# EAGLE design gps_tracker_org1411 (EAGLE 7.4.0)

## Sheet 1 of 2
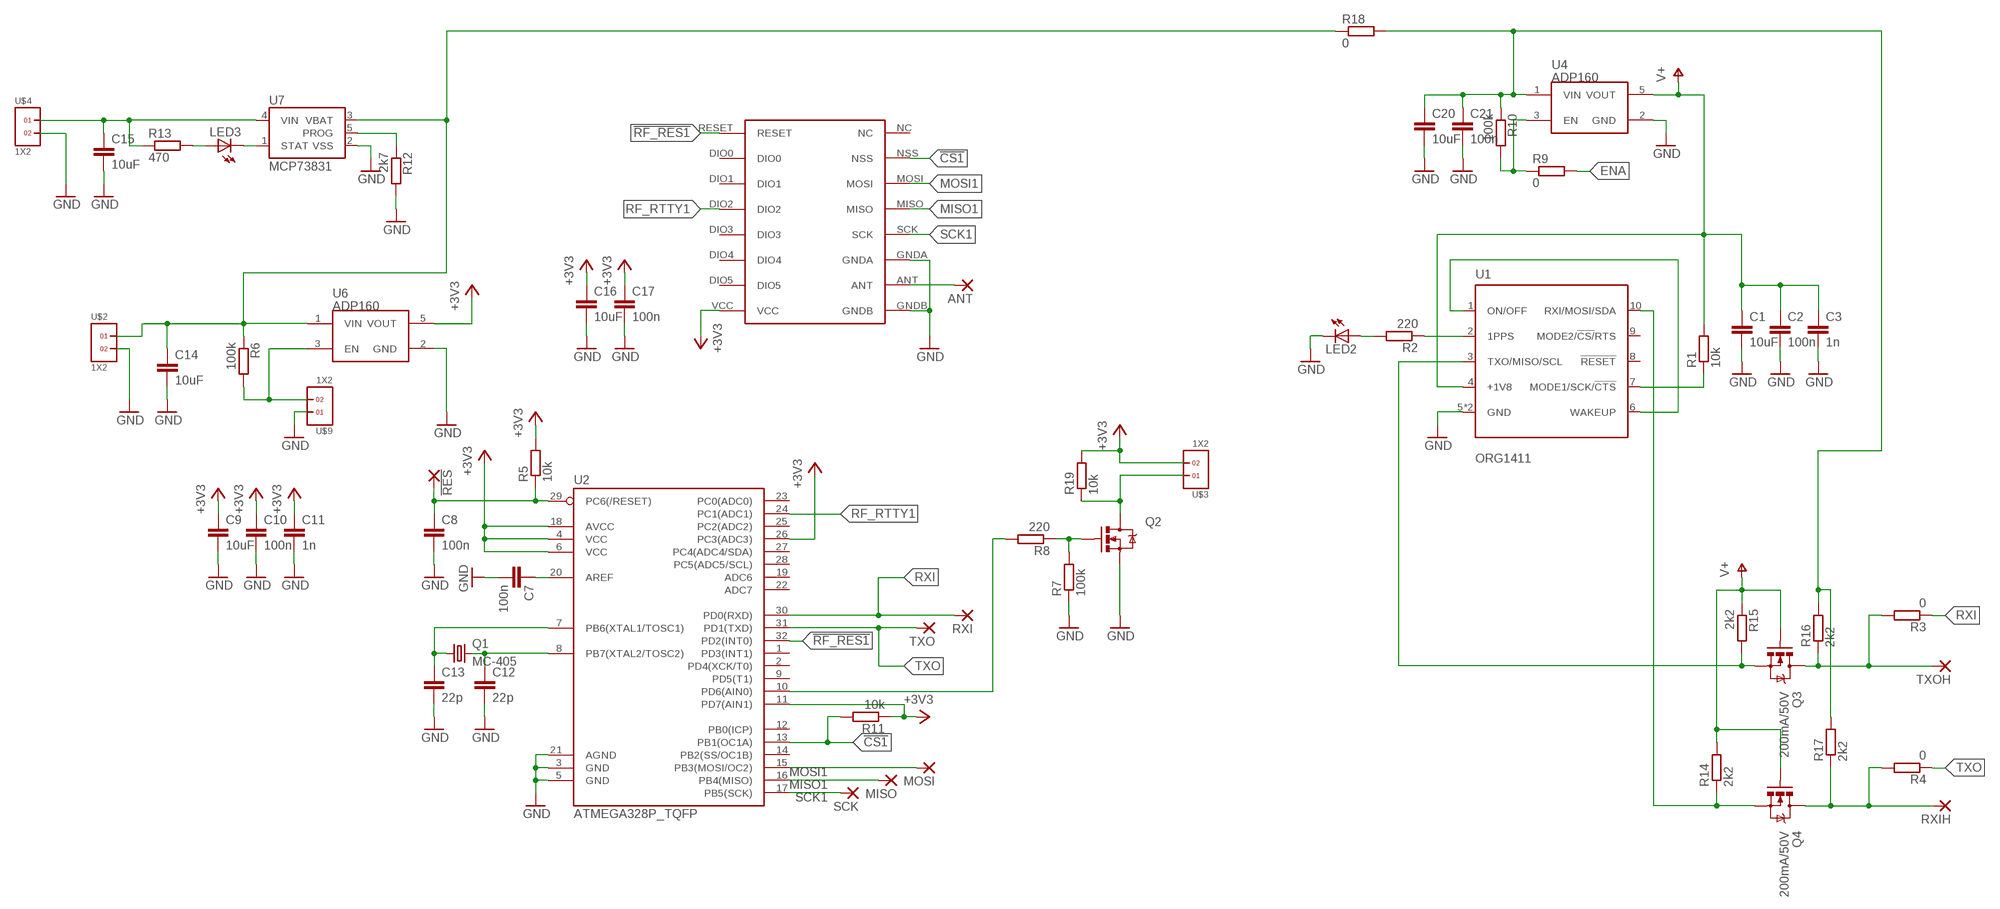
[diagram p0: schematic, sheet 1]

### Parts
!RES  SMD2  [SMD1,27-2,54]
ANT  SMD2  [SMD1,27-2,54]
C1  10uF  C-EUC0603  [C0603]
C2  100n  C-EUC0603  [C0603]
C3  1n  C-EUC0603  [C0603]
C7  100n  C-EUC0603  [C0603]
C8  100n  C-EUC0603  [C0603]
C9  10uF  C-EUC0603  [C0603]
C10  100n  C-EUC0603  [C0603]
C11  1n  C-EUC0603  [C0603]
C12  22p  C-EUC0603  [C0603]
C13  22p  C-EUC0603  [C0603]
C14  10uF  C-EUC0603  [C0603]
C15  10uF  C-EUC0603  [C0603]
C16  10uF  C-EUC0603  [C0603]
C17  100n  C-EUC0603  [C0603]
C20  10uF  C-EUC0603  [C0603]
C21  100n  C-EUC0603  [C0603]
LED2  LEDCHIPLED_0603  [CHIPLED_0603]
LED3  LEDCHIPLED_0603  [CHIPLED_0603]
MISO  SMD2  [SMD1,27-2,54]
MOSI  SMD2  [SMD1,27-2,54]
Q1  MC-405  [MC-405]
Q2  MOSFET-NCHANNELAO3404A  [SOT23-3]
Q3  200mA/50V  MOSFET-NCHANNELBSS138  [SOT23-3]
Q4  200mA/50V  MOSFET-NCHANNELBSS138  [SOT23-3]
R1  10k  R-EU_R0603  [R0603]
R2  220  R-EU_R0603  [R0603]
R3  0  R-EU_R0603  [R0603]
R4  0  R-EU_R0603  [R0603]
R5  10k  R-EU_R0603  [R0603]
R6  100k  R-EU_R0603  [R0603]
R7  100k  R-EU_R0603  [R0603]
R8  220  R-EU_R0603  [R0603]
R9  0  R-EU_R0603  [R0603]
R10  100k  R-EU_R0603  [R0603]
R11  10k  R-EU_R0603  [R0603]
R12  2k7  R-EU_R0603  [R0603]
R13  470  R-EU_R0603  [R0603]
R14  2k2  R-EU_R0603  [R0603]
R15  2k2  R-EU_R0603  [R0603]
R16  2k2  R-EU_R1206  [R1206]
R17  2k2  R-EU_R1206  [R1206]
R18  0  R-EU_R0603  [R0603]
R19  10k  R-EU_R0603  [R0603]
RXI  SMD2  [SMD1,27-2,54]
RXIH  SMD2  [SMD1,27-2,54]
SCK  SMD2  [SMD1,27-2,54]
TXO  SMD2  [SMD1,27-2,54]
TXOH  SMD2  [SMD1,27-2,54]
U1  ORG1411  [ORG1411]
U2  ATMEGA328P_TQFP  [TQFP32-08]
U4  ADP160  [SOT23-5]
U6  ADP160  [SOT23-5]
U7  MCP73831  [SOT23-5]
U$2  1X2  [1X2]
U$3  1X2  [1X2]
U$4  1X2  [1X2]
U$5  RFM69HW  [RFM]
U$9  1X2  [1X2]

### Nets
!CS1: R11.2 U2.13(PB1(OC1A)) U$5.NSS
!RF_RES1: U2.32(PD2(INT0)) U$5.RESET
+3V3_1: C9.1 C10.1 C11.1 C16.1 C17.1 R5.2 R11.1 R19.2 U2.4(VCC) U2.6(VCC) U2.11(PD7(AIN1)) U2.18(AVCC) U2.26(PC3(ADC3)) U6.5(VOUT) U$3.2 U$5.VCC ; supply symbol labelled +3V3
+BAT: C14.1 R6.1 R18.1 U6.1(VIN) U7.3(VBAT) U$2.1
ENA: R6.2 R9.2 U6.3(EN) U$9.2
GND: C1.2 C2.2 C3.2 C7.2 C8.2 C9.2 C10.2 C11.2 C12.2 C13.2 C14.2 C15.2 C16.2 C17.2 C20.2 C21.2 LED2.C Q2.2(S) R7.1 R12.2 U1.5(GND) U1.11(GND) U2.3(GND) U2.5(GND) U2.21(AGND) U4.2(GND) U6.2(GND) U7.2(VSS) U$2.2 U$4.2 U$5.GNDA U$5.GNDB U$9.1
MISO1: MISO.1(P) U2.16(PB4(MISO)) U$5.MISO
MOSI1: MOSI.1(P) U2.15(PB3(MOSI/OC2)) U$5.MOSI
N1: R9.1 R10.2 U4.3(EN)
N$1: U1.1(ON/OFF) U1.6(WAKEUP)
N$2: R1.1 U1.7(MODE1/SCK/!CTS)
N$3: R2.1 U1.2(1PPS)
N$4: LED2.A R2.2
N$5: Q3.2(S) R15.2 U1.3(TXO/MISO/SCL)
N$6: C20.1 C21.1 R10.1 R16.2 R17.2 R18.2 U4.1(VIN)
N$11: R12.1 U7.5(PROG)
N$12: C7.1 U2.20(AREF)
N$13: !RES.1(P) C8.1 R5.1 U2.29(PC6(/RESET))
N$14: ANT.1(P) U$5.ANT
N$15: C12.1 Q1.2 U2.8(PB7(XTAL2/TOSC2))
N$16: C13.1 Q1.1 U2.7(PB6(XTAL1/TOSC1))
N$18: LED3.C U7.1(STAT)
N$19: Q2.1(G) R7.2 R8.1
N$20: R8.2 U2.10(PD6(AIN0))
N$21: Q2.3(D) R19.1 U$3.1
N$22: LED3.A R13.2
N$24: C15.1 R13.1 U7.4(VIN) U$4.1
N$26: Q3.3(D) R3.2 R16.1 TXOH.1(P)
N$30: Q4.3(D) R4.2 R17.1 RXIH.1(P)
N$32: Q4.2(S) R14.1 U1.10(RXI/MOSI/SDA)
RF_RTTY1: U2.24(PC1(ADC1)) U$5.DIO2
RXI: R3.1 RXI.1(P) U2.30(PD0(RXD))
SCK1: SCK.1(P) U2.17(PB5(SCK)) U$5.SCK
TXO: R4.1 TXO.1(P) U2.31(PD1(TXD))
V+: C1.1 C2.1 C3.1 Q3.1(G) Q4.1(G) R1.2 R14.2 R15.1 U1.4(+1V8) U4.5(VOUT)
Unconnected: U1.8(!RESET) U1.9(MODE2/!CS/!RTS) U2.1(PD3(INT1)) U2.2(PD4(XCK/T0)) U2.9(PD5(T1)) U2.12(PB0(ICP)) U2.14(PB2(SS/OC1B)) U2.19(ADC6) U2.22(ADC7) U2.23(PC0(ADC0)) U2.25(PC2(ADC2)) U2.27(PC4(ADC4/SDA)) U2.28(PC5(ADC5/SCL)) U$5.DIO0 U$5.DIO1 U$5.DIO3 U$5.DIO4 U$5.DIO5 U$5.NC

## Sheet 2 of 2: A2235-H

## Library data of the parts
!RES ANT MISO MOSI RXI RXIH SCK TXO TXOH = wirepad:SMD2: SMD PAD
C1-C3 C7-C17 C20 C21 = rcl:C-EU: CAPACITOR, European symbol
LED2 LED3 = led:LED: LED OSRAM: - CHIPLED LG R971, LG N971, LY N971, LG Q971, LY Q971, LO R971, LY R971 LH N974, LH R974 LS Q976, LO Q976, LY Q976 LO Q996 - Hyper CHIPLED LW Q18S LB Q993, LB Q99A, LB R99A - SideLED LS A670, LO A670, LY A670, LG A670, LP A670 LB A673, LV A673, LT A673, LW A673 LH A674 LY A675 LS A676, LA A676, LO A676, LY A676, LW A676 LS A679, LY A679, LG A679 - Hyper Micro SIDELED® LS Y876, LA Y876, LO Y876, LY Y876 LT Y87S - SmartLED LW L88C, LW L88S LB L89C, LB L89S, LG L890 LS L89K, LO L89K, LY L89K LS L896, LA L896, LO L896, LY L896 - TOPLED LS T670, LO T670, LY T670, LG T670, LP T670 LSG T670, LSP T670, LSY T670, LOP T670, LYG T670 LG T671, LOG T671, LSG T671 LB T673, LV T673, LT T673, LW T673 LH T674 LS T676, LA T676, LO T676, LY T676, LB T676, LH T676, LSB T676, LW T676 LB T67C, LV T67C, LT T67C, LS T67K, LO T67K, LY T67K, LW E67C LS E67B, LA E67B, LO E67B, LY E67B, LB E67C, LV E67C, LT E67C LW T67C LS T679, LY T679, LG T679 LS T770, LO T770, LY T770, LG T770, LP T770 LB T773, LV T773, LT T773, LW T773 LH T774 LS E675, LA E675, LY E675, LS T675 LS T776, LA T776, LO T776, LY T776, LB T776 LHGB T686 LT T68C, LB T68C - Hyper Mini TOPLED® LB M676 - Mini TOPLED Santana® LG M470 LS M47K, LO M47K, LY M47K Source: http://www.osram.convergy.de LUXEON: - LUMILED® LXK2-PW12-R00, LXK2-PW12-S00, LXK2-PW14-U00, LXK2-PW14-V00 LXK2-PM12-R00, LXK2-PM12-S00, LXK2-PM14-U00 LXK2-PE12-Q00, LXK2-PE12-R00, LXK2-PE12-S00, LXK2-PE14-T00, LXK2-PE14-U00 LXK2-PB12-K00, LXK2-PB12-L00, LXK2-PB12-M00, LXK2-PB14-N00, LXK2-PB14-P00, LXK2-PB14-Q00 LXK2-PR12-L00, LXK2-PR12-M00, LXK2-PR14-Q00, LXK2-PR14-R00 LXK2-PD12-Q00, LXK2-PD12-R00, LXK2-PD12-S00 LXK2-PH12-R00, LXK2-PH12-S00 LXK2-PL12-P00, LXK2-PL12-Q00, LXK2-PL12-R00 Source: www.luxeon.com KINGBRIGHT: KA-3528ASYC Source: www.kingbright.com
Q1 = gps_tracker:MC-405: kHz RANGE CRYSTAL UNIT SMD Source: MC-306_405_406_E07X.PDF Homepage <http://www.epsontoyocom.co.jp>; FARNELL: 2508596; OC_FARNELL: unknown; OC_NEWARK: unknown
Q2 = SparkFun-DiscreteSemi:MOSFET-NCHANNEL: Common NMOSFET Parts MFG P/N Store ID Prod ID FDD8780 TRANS-09984 SI7820DN TRANS-11055 FDS6630A IC-08089 2N7002PW TRANS-11151 FQP30N06L COM-10213 TRANS-10060 BSS123LT1G TRANS-08345 BSS138 TRANS-00830 BS170 2N7000; PROD_ID: TRAN-12988
Q3 Q4 = SparkFun-DiscreteSemi:MOSFET-NCHANNEL: Common NMOSFET Parts MFG P/N Store ID Prod ID FDD8780 TRANS-09984 SI7820DN TRANS-11055 FDS6630A IC-08089 2N7002PW TRANS-11151 FQP30N06L COM-10213 TRANS-10060 BSS123LT1G TRANS-08345 BSS138 TRANS-00830 BS170 2N7000; PROD_ID: TRANS-00830
R1-R19 = rcl:R-EU_: RESISTOR, European symbol
U1 = gps_tracker:ORG1411
U2 = SparkFun-DigitalIC:ATMEGA328P_TQFP; PROD_ID: IC-09069
U4 = SparkFun-PowerIC:ADP160: Nanopower LDO Iq less than 1uA for low Iload; FARNELL: 2510505; PROD_ID: VREG-11306
U6 = SparkFun-PowerIC:ADP160: Nanopower LDO Iq less than 1uA for low Iload; FARNELL: 2510377; PROD_ID: VREG-11306
U7 = SparkFun-PowerIC:MCP73831: Miniature single cell, fully integrated Li-Ion, Li-polymer charge management controller http://ww1.microchip.com/downloads/en/DeviceDoc/20001984g.pdf IC-09995; FARNELL: 1834892; PROD_ID: IC-09995
U$2-U$4 U$9 = headers(2mm)(samtec):1X2
U$5 = gps_tracker:RFM69HW

## Board
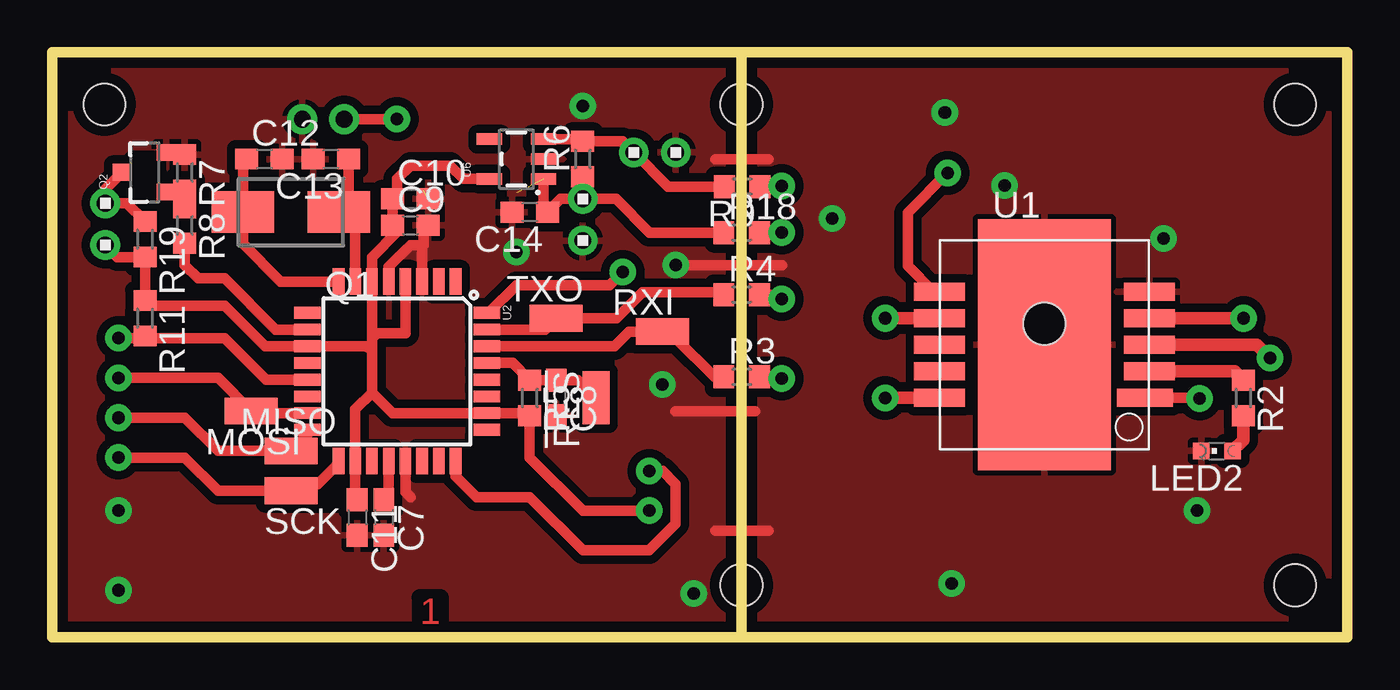
[diagram p1: board, top side]
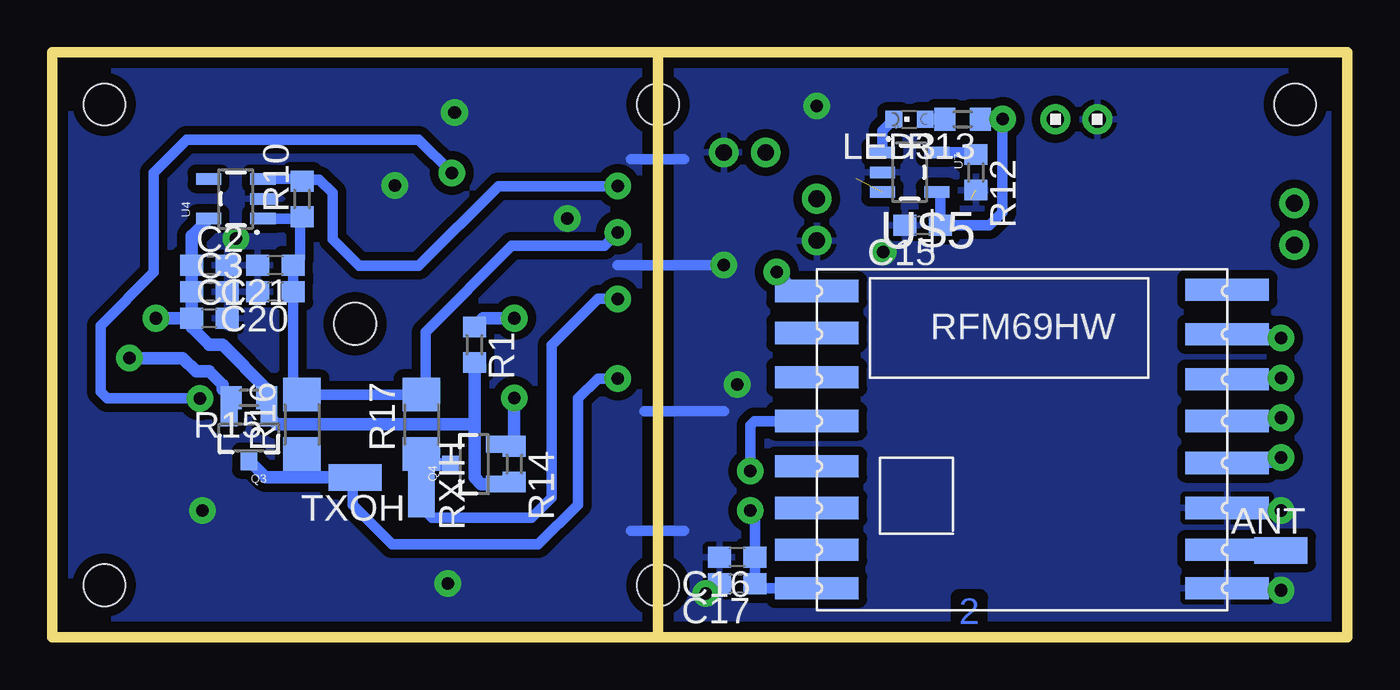
[diagram p2: board, bottom side, seen from below]

Size 62 x 28 mm. Coordinates in mm from the lower left corner, seen from the top.
Outline: 33,28 0,28 0,0 33,0
Outline: 33,28 33,0
Outline: 33,28 62,28 62,0 33,0
Copper layers (1*16): Top 0.035mm / dielectric 1.5mm / Bottom 0.035mm
Design rules "default *": minimum track width 10mil, minimum drill 24mil, track to track 8mil, track to pad 8mil, pad to pad 8mil, via to via 8mil, smd to smd 8mil, copper to edge 20mil, drill to drill 8mil, minimum pad ring 10mil, minimum via ring 8mil, stop-mask expansion 4mil, vias tented up to drill 0mil, thermal gap 10mil
Holes 2 mm at 2.5,25.5 59.5,25.5 33,2.5 33,25.5 59.5,2.5
Holes 3 mm at 2.22,33.97 59.05,33.34 59.37,-4.13 2.22,-5.08
tRestrict: area 3.8,22.3 to 5.1,22.9; area 10.2,21 to 12.7,21.6; area 12.7,24.2 to 13.3,24.8; area 12.7,6.4 to 14,7

### Footprints (pad centres in the part's own frame; a part is rotated, then mirrored left to right if it is on the bottom)
SMD1,27-2,54 = smd 1.27 x 2.54: 1 0,0
C0603 = smd 1.1 x 1: 1 -0.85,0; 2 0.85,0
CHIPLED_0603 = smd 0.8 x 0.8: A 0,-0.75; C 0,0.75
MC-405 = smd 3 x 2: 1 -2.3,0; 2 2.3,0
SOT23-3 = smd 0.8 x 0.9: 1 -0.95,-1; 2 0.95,-1; 3 0,1.1
R0603 = smd 1 x 1.1: 1 -0.85,0; 2 0.85,0
R1206 = smd 1.6 x 1.803: 1 -1.422,0; 2 1.422,0
ORG1411 = smd 2.676 x 0.864: 1 4.818,-2.54 | smd 2.422 x 0.864: 2 5.025,-1.27; 3 5.025,0; 4 5.025,1.27; 5 5.025,2.54; 6 -5.025,2.54; 7 -5.025,1.27; 8 -5.025,0; 9 -5.025,-1.27; 10 -5.025,-2.54 | smd 6.35 x 12: 11 0,0 | hole 2: 0,1
TQFP32-08 = smd 1.27 x 0.559: 1 -4.293,2.8; 2 -4.293,2; 3 -4.293,1.2; 4 -4.293,0.4; 5 -4.293,-0.4; 6 -4.293,-1.2; 7 -4.293,-2; 8 -4.293,-2.8; 17 4.293,-2.8; 18 4.293,-2; 19 4.293,-1.2; 20 4.293,-0.4; 21 4.293,0.4; 22 4.293,1.2; 23 4.293,2; 24 4.293,2.8 | smd 0.559 x 1.27: 9 -2.8,-4.293; 10 -2,-4.293; 11 -1.2,-4.293; 12 -0.4,-4.293; 13 0.4,-4.293; 14 1.2,-4.293; 15 2,-4.293; 16 2.8,-4.293; 25 2.8,4.293; 26 2,4.293; 27 1.2,4.293; 28 0.4,4.293; 29 -0.4,4.293; 30 -1.2,4.293; 31 -2,4.293; 32 -2.8,4.293
SOT23-5 = smd 0.55 x 1.2: 1 -0.95,-1.3; 2 0,-1.3; 3 0.95,-1.3; 4 0.95,1.3; 5 -0.95,1.3
1X2 = drill 0.8 pad 1.422: 1 0,0; 2 2,0
RFM = smd 4 x 1.067: ANT 9.491,-4.731; DIO0 -10.16,5.65; DIO1 -10.16,3.522; DIO2 -10.16,1.427; DIO3 -10.16,-0.731; DIO4 -10.16,-2.731; DIO5 -10.16,-4.731; GNDA 9.491,-2.731; GNDB 9.491,-6.572; MISO 9.491,1.427; MOSI 9.491,3.428; NC 9.491,7.714; NSS 9.491,5.586; RESET -10.16,7.65; SCK 9.491,-0.573; VCC -10.16,-6.572

### Placement (x,y rotation side)
!RES  26.04,11.46 0 top
ANT  3.17,4.16 270 bottom
C1  54.48,15.27 0 bottom
C2  54.48,17.81 0 bottom
C3  54.48,16.54 0 bottom
C7  15.88,5.75 270 top
C8  24.13,11.46 270 top
C9  17.14,19.71 0 top
C10  17.14,20.98 0 top
C11  14.61,5.75 270 top
C12  10.16,22.89 0 top
C13  13.34,22.89 180 top
C14  22.86,20.35 180 top
C15  20.32,19.71 180 bottom
C16  29.21,3.84 180 bottom
C17  29.21,2.57 180 bottom
C20  51.31,16.54 180 bottom
C21  51.31,17.81 180 bottom
LED2  55.76,8.92 90 top
LED3  20.95,24.8 90 bottom
MISO  11.43,8.92 270 top
MOSI  9.53,10.82 90 top
Q1  11.43,20.35 180 top
Q2  4.45,22.25 90 top
Q3  52.58,9.55 180 bottom
Q4  41.78,8.29 90 bottom
R1  41.78,14 270 bottom
R2  57.02,11.46 270 top
R3  33,12.46 0 top
R4  33,16.4 0 top
R5  22.86,11.46 270 top
R6  25.4,22.89 90 top
R7  6.35,22.25 270 top
R8  6.35,19.71 270 top
R9  33.04,21.57 180 top
R10  50.04,20.98 90 bottom
R11  4.45,15.27 270 top
R12  17.78,22.25 270 bottom
R13  18.41,24.8 180 bottom
R14  39.88,8.29 270 bottom
R15  52.58,11.46 180 bottom
R16  50.04,10.19 90 bottom
R17  44.33,10.19 90 bottom
R18  33,19.37 0 top
R19  4.45,19.05 270 top
RXI  29.21,14.63 270 top
RXIH  44.33,7.01 180 bottom
SCK  11.43,7.01 90 top
TXO  24.13,15.27 270 top
TXOH  47.5,7.65 90 bottom
U1  47.5,14 0 top
U2  16.51,12.73 270 top
U4  53.22,20.98 90 bottom
U6  22.23,22.89 90 top
U7  20.95,22.25 270 bottom
U$2  25.4,20.98 270 top
U$3  2.54,20.77 270 top
U$4  13.97,24.8 0 bottom
U$5  15.24,8.92 0 bottom
U$9  29.85,23.21 180 top

### Tracks (layer width: path | path; a pad name or v marks a point on that pad's centre or on a via)
!CS1  (via drill 0.6 pad 1.27)
  Top 0.5: U2.13 10.24,12.33 8.26,14.32 4.55,14.32 R11.2 4.34,14.32 v3.18,14.32
  Bottom 0.5: 2.99,14.51 v3.18,14.32 3.37,14.51 U$5.NSS
!RF_RES1  (via drill 0.6 pad 1.27)
  Top 0.5: v27.31,17.49 26.67,16.86 22.23,16.86 20.9,15.53 U2.32
  Bottom 0.5: U$5.RESET 26.38,16.57 v27.31,17.49
+3V3_1  (via drill 0.6 pad 1.27)
  Top 0.5: v28.58,6.06 25.4,6.06 22.86,8.6 R5.2 22.74,10.73 U2.26 16.29,10.73 15.31,11.71 | C11.1 14.51,6.69 U2.18 14.51,10.91 15.31,11.71 | 15.31,14.32 U2.6 15.31,18.2 16.51,19.4 16.51,19.5 C9.1 | 15.31,14.32 15.31,13.68 | 15.31,13.68 15.31,11.71 | 15.31,13.68 15.06,13.93 U2.11 10.2,13.93 8.26,15.88 4.69,15.88 R11.1 R19.2 3.12,18.2 U$3.2 | U2.4 16.91,14.55 15.55,14.55 15.31,14.32 | U6.5 19.68,21.94 19.05,22.57 17.15,22.57 16.51,21.94 16.51,21.2 C10.1 C9.1 | C9.1 16.19,19.71
  Bottom 0.5: v28.58,6.06 28.36,5.85 C16.1 C17.1 28.14,2.35 U$5.VCC
+BAT  (1 unrouted)
  Top 0.5: U$2.1 R6.1 | U6.1 23.52,20.54 C14.1 24.34,20.98 U$2.1 | U$2.1 26.99,20.98 28.61,19.37 R18.1
ENA
  Top 0.5: U6.3 25.3,23.84 R6.2 27.31,23.74 U$9.2 29.48,21.57 R9.2
GND  (via drill 0.6 pad 1.27)  (1 unrouted)
  Top 0.5: U2.21 16.91,6.93 17.15,6.7 | Q2.2 6.25,23.2 R7.1 | U2.5 16.11,17.73 17.15,18.76 17.78,18.76 | 17.78,18.76 17.78,19.5 C9.2 | U2.3 17.71,18.69 17.78,18.76 | 34.29,5.11 31.75,5.11 | 34.93,17.81 v29.85,17.81 | 34.29,22.89 31.75,22.89 | 33.66,10.82 29.85,10.82
  Bottom 0.5: 34.29,5.11 31.75,5.11 | 34.93,17.81 v29.85,17.81 | 34.29,22.89 31.75,22.89 | 33.66,10.82 29.85,10.82
  other vias: 53.22,19.08 42.74,25.11 3.18,6.06 3.18,2.25 22.23,18.45 29.21,12.1 25.4,25.43 30.71,2.1 43.05,2.57 54.8,6.06 45.59,21.62 37.34,20.03
  pour Bottom (isolate 0.406): 62.23,-1.24 62.23,29.24 -1.27,29.24 -1.27,-1.24
  pour Top (isolate 0.406): 62.23,-1.24 62.23,29.24 -1.27,29.24 -1.27,-1.24
MISO1  (via drill 0.6 pad 1.27)
  Top 0.5: U2.16 12.22,9.71 MISO.1 7.94,8.92 6.35,10.51 v3.18,10.51
  Bottom 0.5: U$5.MISO 3.34,10.35 v3.18,10.51
MOSI1  (via drill 0.6 pad 1.27)
  Top 0.5: U2.15 9.62,10.73 MOSI.1 7.94,12.41 v3.18,12.41
  Bottom 0.5: U$5.MOSI 3.24,12.35 v3.18,12.41
N1  (via drill 0.6 pad 1.27)
  Top 0.5: R9.1 34.91,21.57 v34.92,21.59
  Bottom 0.5: U4.3 50.14,21.93 R10.2 49.97,21.91 49.21,21.91 48.58,21.27 48.58,19.05 47.31,17.78 44.45,17.78 40.64,21.59 v34.92,21.59
N$1  (via drill 0.6 pad 1.27)
  Top 0.5: U1.6 42.2,16.54 40.96,17.78 40.96,20.32 v42.86,22.23 | U1.1 54.9,11.46 v54.93,11.43
  Bottom 0.5: v54.93,11.43 59.37,11.43 59.69,11.75 59.69,14.92 57.15,17.46 57.15,22.23 55.56,23.81 44.45,23.81 v42.86,22.23
N$2  (via drill 0.6 pad 1.27)
  Top 0.61: U1.7 v39.88,15.27
  Bottom 0.61: v39.88,15.27 41.37,15.27 R1.1
N$3
  Top 0.61: U1.2 56.6,12.73 R2.1
N$4
  Top 0.61: R2.2 57.02,9.44 LED2.A
N$5  (via drill 0.6 pad 1.27)
  Top 0.61: U1.3 57.66,14 v58.3,13.37
  Bottom 0.61: v58.3,13.37 55.76,13.37 55.12,12.73 54.48,12.73 53.85,12.1 53.85,11.88 R15.2 53.43,10.65 Q3.2
N$6  (via drill 0.6 pad 1.27)
  Top 0.5: R18.2 v34.92,19.37
  Bottom 0.5: U4.1 50.14,20.04 | 50.14,20.04 R10.1 49.91,20 | 50.14,20.04 50.14,18.13 C21.1 C20.1 50.46,12.03 R16.2 R17.2 44.13,11.8 44.13,14.61 40.01,18.73 35.56,18.73 v34.92,19.37
N$11
  Bottom 0.5: U7.5 17.88,23.2 R12.1
N$12
  Top 0.5: U2.20 16.11,6.83 C7.1
N$13
  Top 0.5: U2.29 22.04,13.13 R5.1 C8.1 25.18,12.31 !RES.1
N$14
  Bottom 0.5: ANT.1 3.81,4.16 | 3.81,4.16 5.72,4.16 | U$5.ANT 3.84,4.19 3.81,4.16
N$15
  Top 0.5: U2.8 10.95,17.02 9.13,18.84 Q1.2 9.13,22.71 C12.1
N$16
  Top 0.5: U2.7 14.51,19.57 Q1.1 14.19,20.8 C13.1
N$18
  Bottom 0.5: U7.1 22.25,24.25 LED3.C
N$19
  Top 0.5: Q2.1 6.25,21.3 R7.2 R8.1
N$20
  Top 0.5: U2.10 10.7,14.73 8.26,17.18 6.99,17.18 6.35,17.81 R8.2
N$21
  Top 0.5: Q2.3 2.54,21.45 U$3.1 3.57,20.77 R19.1
N$22
  Bottom 0.5: LED3.A R13.2
N$24  (via drill 0.6 pad 1.27)
  Top 0.5: U$4.1 v16.51,24.8
  Bottom 0.5: U7.4 19.47,21.12 C15.1 17.14,19.71 16.51,20.35 v16.51,24.8 R13.1
N$26  (via drill 0.6 pad 1.27)
  Top 0.5: R3.2 34.84,12.46 v34.92,12.38
  Bottom 0.5: v34.92,12.38 35.88,12.38 36.83,11.43 36.83,6.35 38.73,4.45 45.72,4.45 47.62,6.35 47.62,7.53 TXOH.1
  Bottom 0.61: TXOH.1 50.04,7.65 | 50.04,7.65 51.77,7.65 Q3.3 | R16.1 50.04,7.65
N$30  (via drill 0.6 pad 1.27)
  Top 0.5: R4.2 34.72,16.4 v34.92,16.19
  Bottom 0.5: v34.92,16.19 35.88,16.19 38.1,13.97 38.1,6.67 39.05,5.71 43.81,5.71 44.45,6.35 44.45,6.89 RXIH.1
  Bottom 0.61: Q4.3 43.84,8.29 R17.1 RXIH.1
N$32  (via drill 0.6 pad 1.27)
  Top 0.61: U1.10 v39.88,11.46
  Bottom 0.61: v39.88,11.46 R14.1 39.98,9.23 Q4.2
RF_RTTY1  (via drill 0.6 pad 1.27)
  Top 0.5: v28.58,7.97 29.21,7.97 29.85,7.33 29.85,5.43 28.58,4.16 25.4,4.16 22.86,6.7 20.32,6.7 19.31,7.71 U2.24
  Bottom 0.5: U$5.DIO2 28.39,10.35 28.57,10.16 v28.57,7.97 v28.58,7.97
RXI
  Top 0.5: U2.30 26.92,13.93 27.62,14.63 RXI.1 29.53,14.32 29.85,14.32 31.7,12.46 R3.1
SCK1  (via drill 0.6 pad 1.27)
  Top 0.5: U2.17 13.71,8.34 12.7,7.33 11.75,7.33 SCK.1 7.94,7.01 6.35,8.6 v3.18,8.6
  Bottom 0.5: U$5.SCK 3.43,8.35 v3.18,8.6
TXO
  Top 0.5: U2.31 23.59,14.73 TXO.1 27.02,15.27 28.26,16.51 32.04,16.51 R4.1
V+  (via drill 0.6 pad 1.27)
  Top 0.61: U1.4 v57.02,15.27
  Bottom 0.61: v57.02,15.27 C1.1 | C1.1 C3.1 C2.1 55.34,19.21 U4.5 | C1.1 55.34,14.85 54.48,14 53.85,14 51.73,11.88 R15.1 51.63,11.36 Q3.1 51.27,10.19 41.78,10.19 | R14.2 39.98,7.33 Q4.1 41.47,7.33 41.78,7.65 41.78,10.19 | 41.78,10.19 R1.2

### Text on the board
Top: 1
Bottom: 2